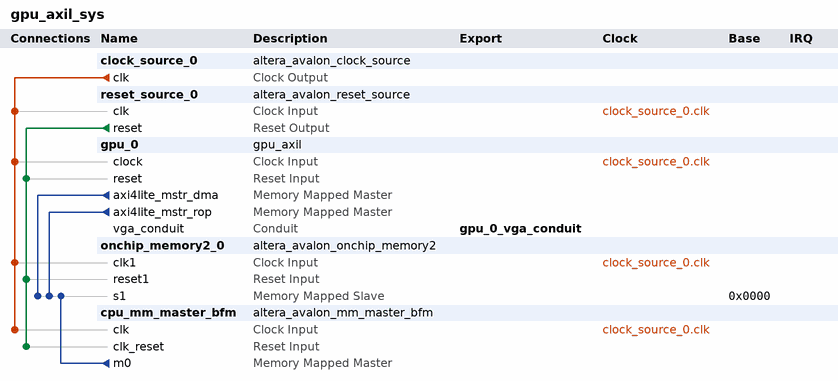
[diagram p0: system contents]
# Platform Designer (Qsys) system gpu_axil_sys, Cyclone V 5CSEMA5F31C6
# Parameters at their usual value, and those the tool derives, are not listed.
package require -exact qsys 22.1
create_system gpu_axil_sys
set_project_property DEVICE_FAMILY {Cyclone V}
set_project_property DEVICE 5CSEMA5F31C6

add_instance clock_source_0 altera_avalon_clock_source 22.1
set_instance_parameter_value clock_source_0 CLOCK_RATE 50
set_instance_parameter_value clock_source_0 CLOCK_UNIT 1000000

add_instance reset_source_0 altera_avalon_reset_source 22.1
set_instance_parameter_value reset_source_0 ASSERT_HIGH_RESET 1
set_instance_parameter_value reset_source_0 INITIAL_RESET_CYCLES 10

add_instance gpu_0 gpu_axil 1.0

add_instance onchip_memory2_0 altera_avalon_onchip_memory2 22.1
set_instance_parameter_value onchip_memory2_0 dataWidth 16
set_instance_parameter_value onchip_memory2_0 dualPort false
set_instance_parameter_value onchip_memory2_0 initMemContent false
set_instance_parameter_value onchip_memory2_0 initializationFileName onchip_mem.hex
set_instance_parameter_value onchip_memory2_0 memorySize 67108864

add_instance cpu_mm_master_bfm altera_avalon_mm_master_bfm 22.1
set_instance_parameter_value cpu_mm_master_bfm ADDRESS_UNITS SYMBOLS
set_instance_parameter_value cpu_mm_master_bfm AV_ADDRESS_W 32
set_instance_parameter_value cpu_mm_master_bfm AV_ALWAYS_BURST_MAX_BURST 0
set_instance_parameter_value cpu_mm_master_bfm AV_BURSTCOUNT_W 3
set_instance_parameter_value cpu_mm_master_bfm AV_BURST_BNDR_ONLY 1
set_instance_parameter_value cpu_mm_master_bfm AV_BURST_LINEWRAP 1
set_instance_parameter_value cpu_mm_master_bfm AV_CONSTANT_BURST_BEHAVIOR 1
set_instance_parameter_value cpu_mm_master_bfm AV_FIX_READ_LATENCY 1
set_instance_parameter_value cpu_mm_master_bfm AV_MAX_PENDING_WRITES 0
set_instance_parameter_value cpu_mm_master_bfm AV_NUMSYMBOLS 4
set_instance_parameter_value cpu_mm_master_bfm AV_READRESPONSE_W 8
set_instance_parameter_value cpu_mm_master_bfm AV_READ_WAIT_TIME 1
set_instance_parameter_value cpu_mm_master_bfm AV_WRITERESPONSE_W 8
set_instance_parameter_value cpu_mm_master_bfm USE_BURSTCOUNT 1
set_instance_parameter_value cpu_mm_master_bfm USE_BYTE_ENABLE 1
set_instance_parameter_value cpu_mm_master_bfm USE_READ 1
set_instance_parameter_value cpu_mm_master_bfm USE_READ_DATA 1
set_instance_parameter_value cpu_mm_master_bfm USE_READ_DATA_VALID 1
set_instance_parameter_value cpu_mm_master_bfm USE_WAIT_REQUEST 1
set_instance_parameter_value cpu_mm_master_bfm VHDL_ID 0

# connections
add_connection clock_source_0.clk cpu_mm_master_bfm.clk clock
add_connection clock_source_0.clk gpu_0.clock clock
add_connection clock_source_0.clk onchip_memory2_0.clk1 clock
add_connection clock_source_0.clk reset_source_0.clk clock
add_connection reset_source_0.reset cpu_mm_master_bfm.clk_reset reset
add_connection reset_source_0.reset gpu_0.reset reset
add_connection reset_source_0.reset onchip_memory2_0.reset1 reset
add_connection cpu_mm_master_bfm.m0 onchip_memory2_0.s1 avalon
set_connection_parameter_value cpu_mm_master_bfm.m0/onchip_memory2_0.s1 baseAddress 0x0000
add_connection gpu_0.axi4lite_mstr_dma onchip_memory2_0.s1 avalon
set_connection_parameter_value gpu_0.axi4lite_mstr_dma/onchip_memory2_0.s1 baseAddress 0x0000
add_connection gpu_0.axi4lite_mstr_rop onchip_memory2_0.s1 avalon
set_connection_parameter_value gpu_0.axi4lite_mstr_rop/onchip_memory2_0.s1 baseAddress 0x0000

# exported interfaces
add_interface gpu_0_vga_conduit conduit end
set_interface_property gpu_0_vga_conduit EXPORT_OF gpu_0.vga_conduit

set_interconnect_requirement {$system} qsys_mm.clockCrossingAdapter HANDSHAKE
set_interconnect_requirement {$system} qsys_mm.enableEccProtection FALSE
set_interconnect_requirement {$system} qsys_mm.insertDefaultSlave FALSE
set_interconnect_requirement {$system} qsys_mm.maxAdditionalLatency 1

save_system gpu_axil_sys.qsys
